# EAGLE schematic mcb-enhancer-v2 (EAGLE 6.3)
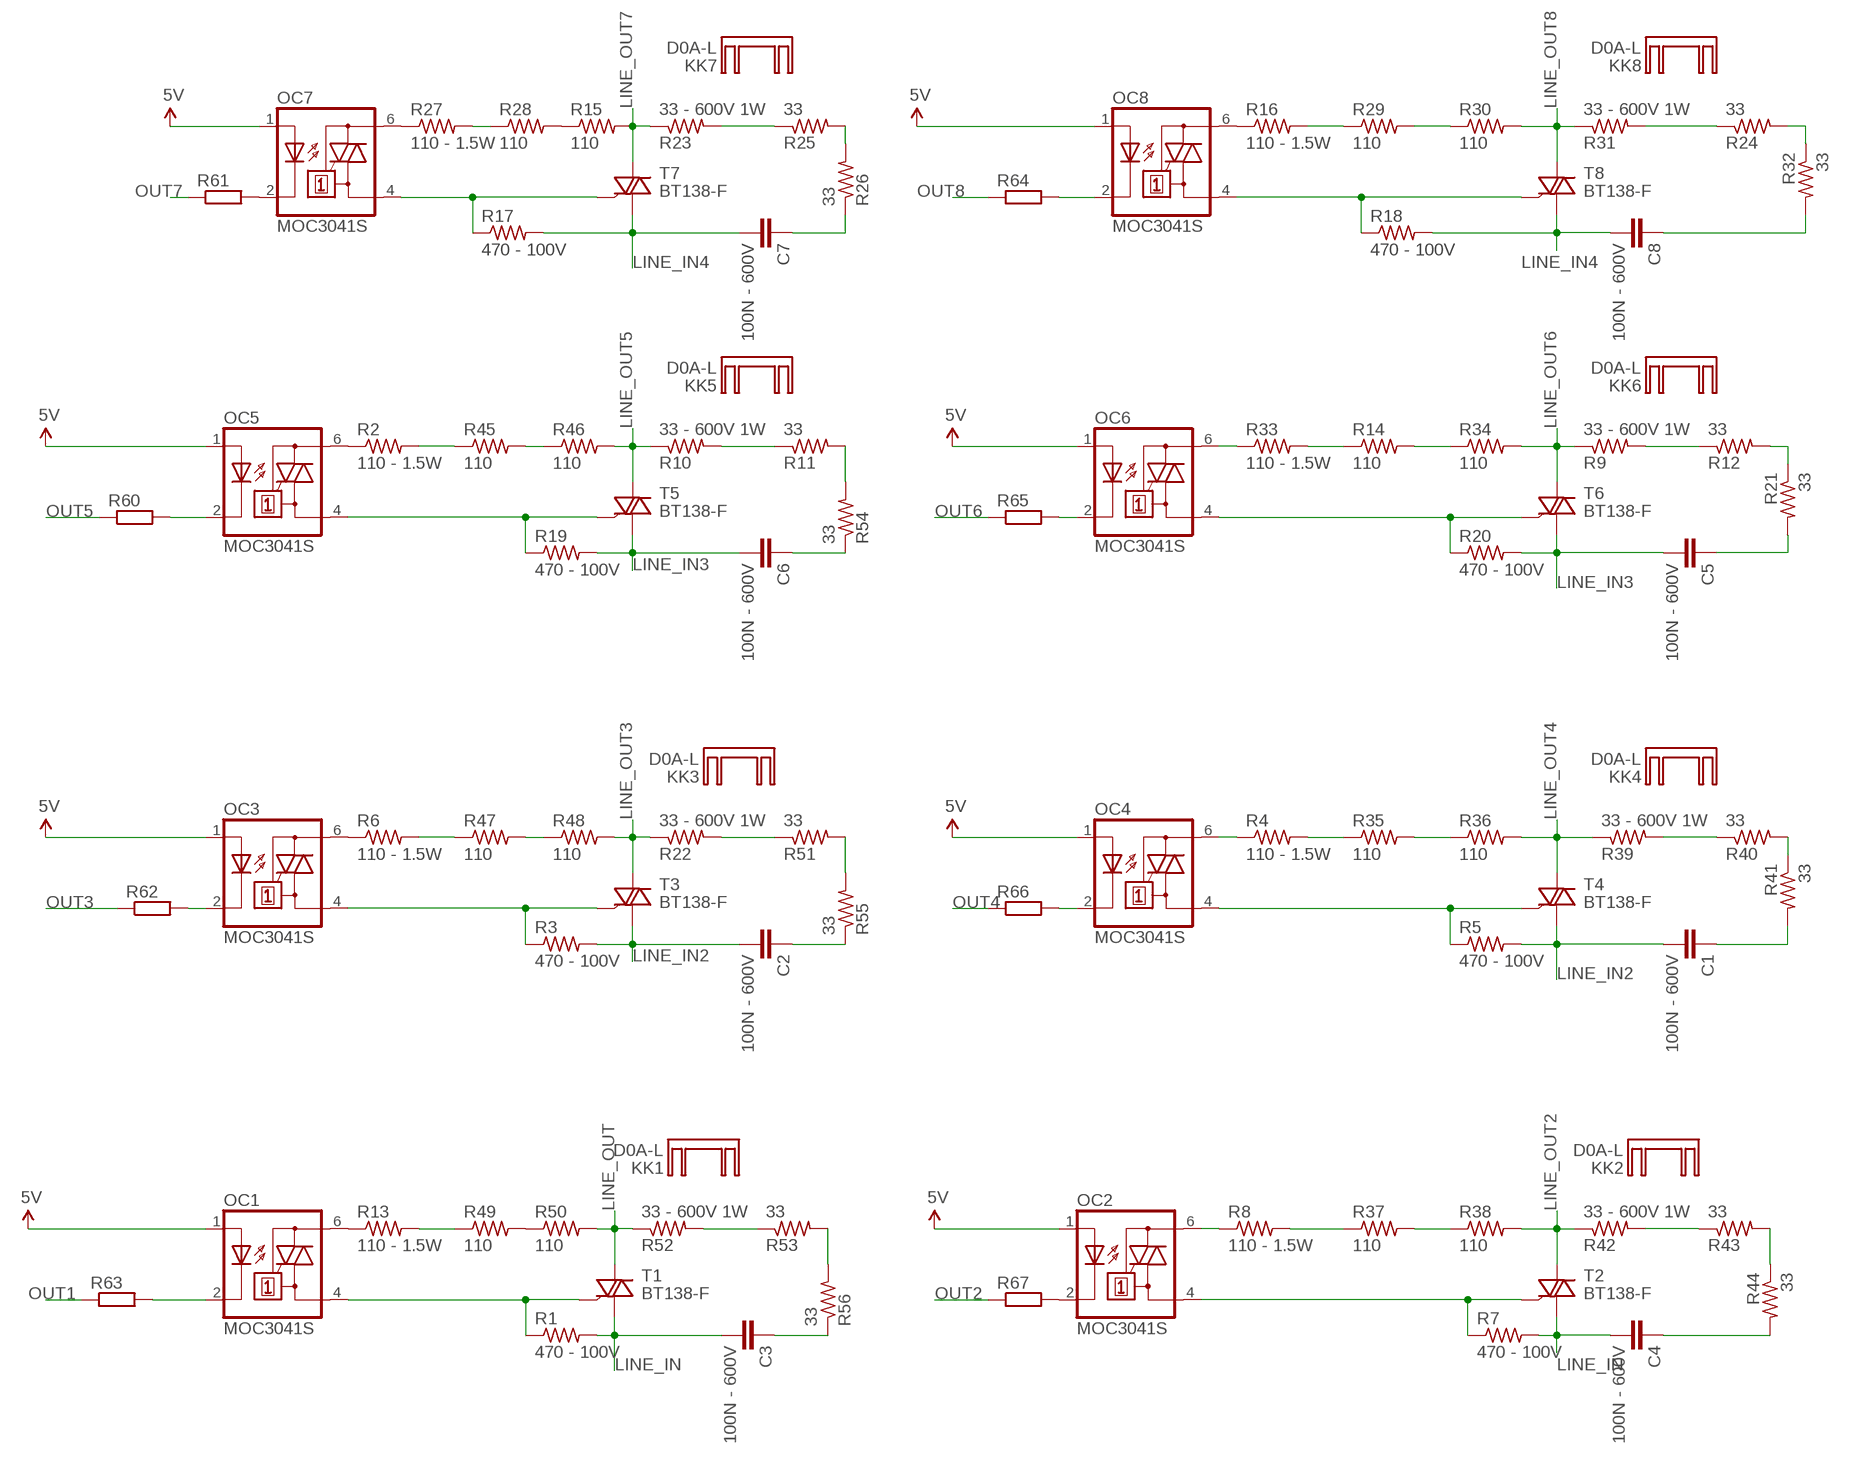
[diagram p0: schematic, sheet 1]

## Parts
C1  100N - 600V  C-EU050-030X075  [C050-030X075]
C2  100N - 600V  C-EU050-030X075  [C050-030X075]
C3  100N - 600V  C-EU050-030X075  [C050-030X075]
C4  100N - 600V  C-EU050-030X075  [C050-030X075]
C5  100N - 600V  C-EU050-030X075  [C050-030X075]
C6  100N - 600V  C-EU050-030X075  [C050-030X075]
C7  100N - 600V  C-EU050-030X075  [C050-030X075]
C8  100N - 600V  C-EU050-030X075  [C050-030X075]
KK1  D0A-L  [D02A-L]
KK2  D0A-L  [D02A-L]
KK3  D0A-L  [D02A-L]
KK4  D0A-L  [D02A-L]
KK5  D0A-L  [D02A-L]
KK6  D0A-L  [D02A-L]
KK7  D0A-L  [D02A-L]
KK8  D0A-L  [D02A-L]
OC1  MOC3041S  [DIL6-SMD]
OC2  MOC3041S  [DIL6-SMD]
OC3  MOC3041S  [DIL6-SMD]
OC4  MOC3041S  [DIL6-SMD]
OC5  MOC3041S  [DIL6-SMD]
OC6  MOC3041S  [DIL6-SMD]
OC7  MOC3041S  [DIL6-SMD]
OC8  MOC3041S  [DIL6-SMD]
R1  470 - 100V  R-US_M1206  [M1206]
R2  110 - 1.5W  R-US_R2512  [R2512]
R3  470 - 100V  R-US_M1206  [M1206]
R4  110 - 1.5W  R-US_R2512  [R2512]
R5  470 - 100V  R-US_M1206  [M1206]
R6  110 - 1.5W  R-US_R2512  [R2512]
R7  470 - 100V  R-US_M1206  [M1206]
R8  110 - 1.5W  R-US_R2512  [R2512]
R9  33 - 600V 1W  R-US_M1206  [M1206]
R10  33 - 600V 1W  R-US_M1206  [M1206]
R11  33  R-US_M1206  [M1206]
R12  33  R-US_M1206  [M1206]
R13  110 - 1.5W  R-US_R2512  [R2512]
R14  110  R-US_R2512  [R2512]
R15  110  R-US_R2512  [R2512]
R16  110 - 1.5W  R-US_R2512  [R2512]
R17  470 - 100V  R-US_M1206  [M1206]
R18  470 - 100V  R-US_M1206  [M1206]
R19  470 - 100V  R-US_M1206  [M1206]
R20  470 - 100V  R-US_M1206  [M1206]
R21  33  R-US_M1206  [M1206]
R22  33 - 600V 1W  R-US_M1206  [M1206]
R23  33 - 600V 1W  R-US_M1206  [M1206]
R24  33  R-US_M1206  [M1206]
R25  33  R-US_M1206  [M1206]
R26  33  R-US_M1206  [M1206]
R27  110 - 1.5W  R-US_R2512  [R2512]
R28  110  R-US_R2512  [R2512]
R29  110  R-US_R2512  [R2512]
R30  110  R-US_R2512  [R2512]
R31  33 - 600V 1W  R-US_M1206  [M1206]
R32  33  R-US_M1206  [M1206]
R33  110 - 1.5W  R-US_R2512  [R2512]
R34  110  R-US_R2512  [R2512]
R35  110  R-US_R2512  [R2512]
R36  110  R-US_R2512  [R2512]
R37  110  R-US_R2512  [R2512]
R38  110  R-US_R2512  [R2512]
R39  33 - 600V 1W  R-US_M1206  [M1206]
R40  33  R-US_M1206  [M1206]
R41  33  R-US_M1206  [M1206]
R42  33 - 600V 1W  R-US_M1206  [M1206]
R43  33  R-US_M1206  [M1206]
R44  33  R-US_M1206  [M1206]
R45  110  R-US_R2512  [R2512]
R46  110  R-US_R2512  [R2512]
R47  110  R-US_R2512  [R2512]
R48  110  R-US_R2512  [R2512]
R49  110  R-US_R2512  [R2512]
R50  110  R-US_R2512  [R2512]
R51  33  R-US_M1206  [M1206]
R52  33 - 600V 1W  R-US_M1206  [M1206]
R53  33  R-US_M1206  [M1206]
R54  33  R-US_M1206  [M1206]
R55  33  R-US_M1206  [M1206]
R56  33  R-US_M1206  [M1206]
R60  R-EU_R0603  [R0603]
R61  R-EU_R0603  [R0603]
R62  R-EU_R0603  [R0603]
R63  R-EU_R0603  [R0603]
R64  R-EU_R0603  [R0603]
R65  R-EU_R0603  [R0603]
R66  R-EU_R0603  [R0603]
R67  R-EU_R0603  [R0603]
T1  BT138-F  [TO220BF]
T2  BT138-F  [TO220BF]
T3  BT138-F  [TO220BF]
T4  BT138-F  [TO220BF]
T5  BT138-F  [TO220BF]
T6  BT138-F  [TO220BF]
T7  BT138-F  [TO220BF]
T8  BT138-F  [TO220BF]

## Nets
5V: OC1.1(A) OC2.1(A) OC3.1(A) OC4.1(A) OC5.1(A) OC6.1(A) OC7.1(A) OC8.1(A)
LINE_IN: C3.2 C4.2 R1.2 R7.2 T1.T1(A1) T2.T1(A1)
LINE_IN2: C1.2 C2.2 R3.2 R5.2 T3.T1(A1) T4.T1(A1)
LINE_IN3: C5.2 C6.2 R19.2 R20.2 T5.T1(A1) T6.T1(A1)
LINE_IN4: C7.2 C8.2 R17.2 R18.2 T7.T1(A1) T8.T1(A1)
LINE_OUT: R50.2 R52.1 T1.T2(A2)
LINE_OUT2: R38.2 R42.1 T2.T2(A2)
LINE_OUT3: R22.1 R48.2 T3.T2(A2)
LINE_OUT4: R36.2 R39.1 T4.T2(A2)
LINE_OUT5: R10.1 R46.2 T5.T2(A2)
LINE_OUT6: R9.1 R34.2 T6.T2(A2)
LINE_OUT7: R15.2 R23.1 T7.T2(A2)
LINE_OUT8: R30.2 R31.1 T8.T2(A2)
N$1: OC5.6(A2) R2.1
N$2: OC2.6(A2) R8.1
N$3: OC3.4(A1) R3.1 T3.G
N$4: OC3.6(A2) R6.1
N$5: OC4.4(A1) R5.1 T4.G
N$6: OC1.2(C) R63.2
N$7: R9.2 R12.1
N$8: R49.2 R50.1
N$9: R52.2 R53.1
N$10: OC1.6(A2) R13.1
N$11: OC1.4(A1) R1.1 T1.G
N$12: R8.2 R37.1
N$13: OC2.4(A1) R7.1 T2.G
N$14: R45.2 R46.1
N$15: OC2.2(C) R67.2
N$16: R23.2 R25.1
N$17: R25.2 R26.2
N$18: OC3.2(C) R62.2
N$19: OC4.2(C) R66.2
N$20: C7.1 R26.1
N$21: R12.2 R21.1
N$22: OC7.2(C) R61.2
N$23: OC7.6(A2) R27.1
N$24: OC8.2(C) R64.2
N$25: R15.1 R28.2
N$26: R27.2 R28.1
N$27: OC5.2(C) R60.2
N$28: OC6.2(C) R65.2
N$29: R16.2 R29.1
N$30: OC7.4(A1) R17.1 T7.G
N$31: OC8.6(A2) R16.1
N$32: OC8.4(A1) R18.1 T8.G
N$33: R29.2 R30.1
N$34: R37.2 R38.1
N$35: OC5.4(A1) R19.1 T5.G
N$36: OC6.4(A1) R20.1 T6.G
N$37: C5.1 R21.2
N$38: OC4.6(A2) R4.1
N$39: C8.1 R32.2
N$40: R24.2 R32.1
N$41: R24.1 R31.2
N$42: R4.2 R35.1
N$43: R35.2 R36.1
N$44: OC6.6(A2) R33.1
N$45: R14.1 R33.2
N$46: R14.2 R34.1
N$47: R39.2 R40.1
N$48: C1.1 R41.2
N$49: R40.2 R41.1
N$50: C4.1 R44.2
N$51: R43.2 R44.1
N$52: R42.2 R43.1
N$53: R47.2 R48.1
N$54: R13.2 R49.1
N$55: R6.2 R47.1
N$56: R2.2 R45.1
N$57: R22.2 R51.1
N$58: R10.2 R11.1
N$59: C3.1 R56.1
N$60: R53.2 R56.2
N$61: C2.1 R55.1
N$62: R51.2 R55.2
N$63: C6.1 R54.1
N$64: R11.2 R54.2
OUT1: R63.1
OUT2: R67.1
OUT3: R62.1
OUT4: R66.1
OUT5: R60.1
OUT6: R65.1
OUT7: R61.1
OUT8: R64.1

## Library data of the parts
C1-C8 = rcl:C-EU: CAPACITOR, European symbol
KK1-KK8 = heatsink:D0A-L: HEATSINK distributor Schukat
OC1-OC8 = optocoupler:MOC30*: 6-Pin DIP Zero-Cross Optoisolators Triac Driver Output (250/400 Volt Peak) Source: http://www.fairchildsemi.com/ds/MO/MOC3043-M.pdf; MF: FAIRCHILD SEMICONDUCTOR; MPN: MOC3033S-M; OC_FARNELL: unknown; OC_NEWARK: 05C2878
R1-R56 = rcl:R-US_: RESISTOR, American symbol
R60-R67 = rcl:R-EU_: RESISTOR, European symbol
T1-T8 = triac:BT138: TRIAC Source: http://www.semiconductors.philips.com BT138_SERIES_2.pdf